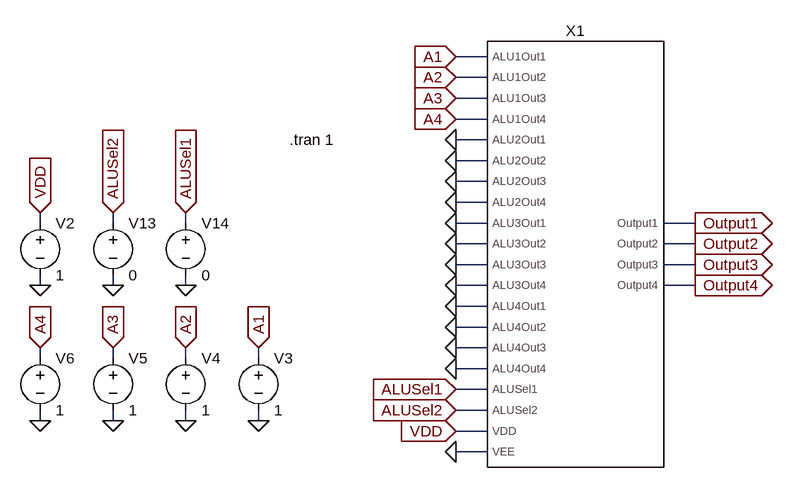
[diagram p0: schematic 16_to_4_Multiplexer_Symbol_Test.asc]
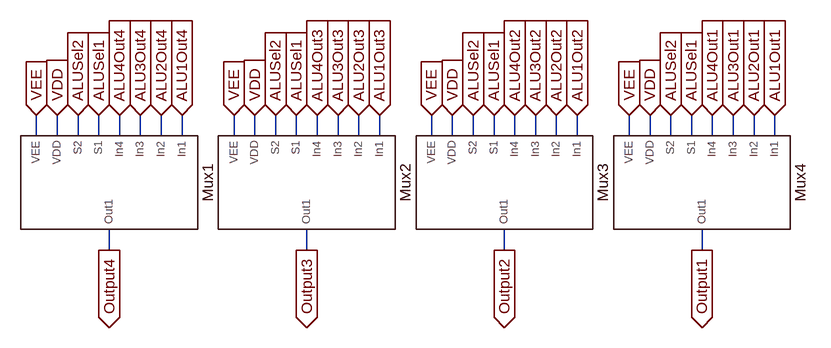
[diagram p1: sub-circuit 16_to_4_multiplexer_symbol.asc]
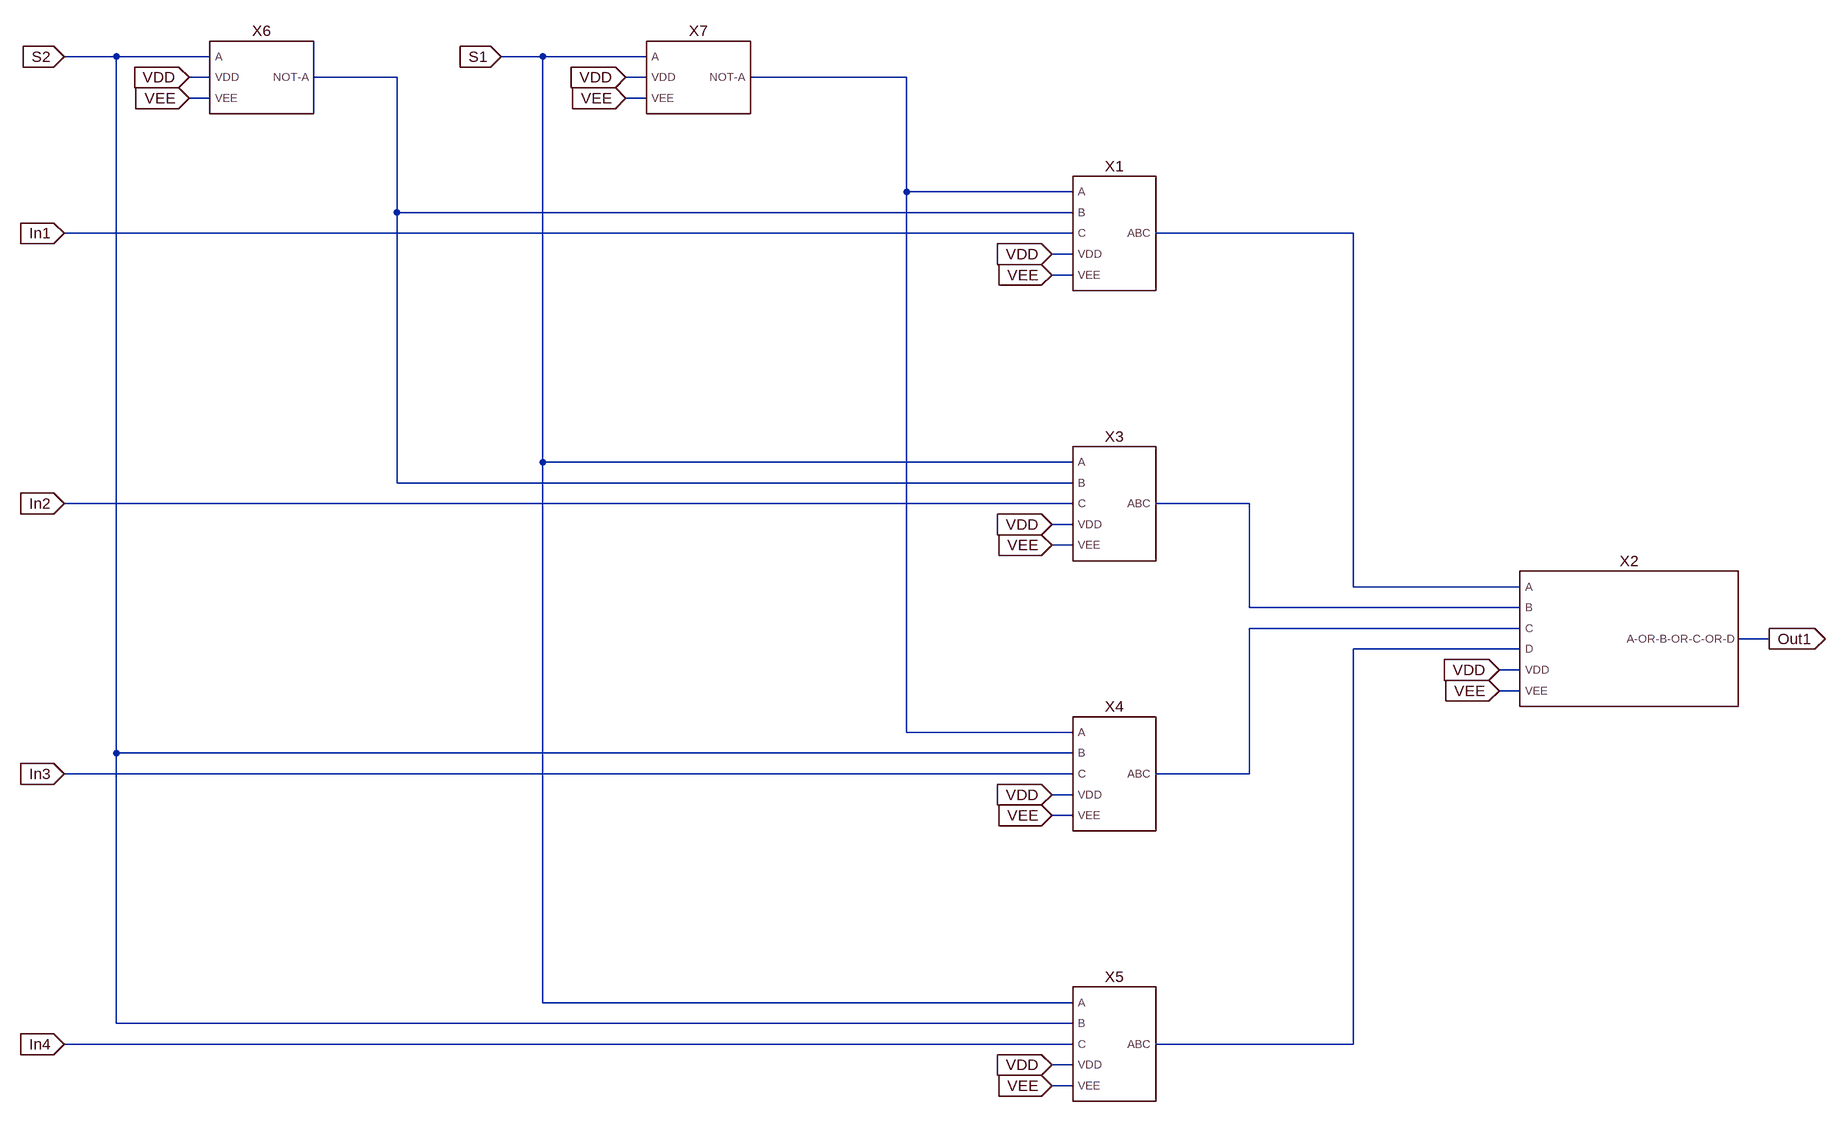
[diagram p2: sub-circuit 4_to_1_multiplexer_symbol.asc]
16_to_4_Multiplexer_Symbol_Test.asc, the LTspice schematic file:
Version 4
SHEET 1 1000 704
WIRE 544 48 496 48
WIRE 544 80 496 80
WIRE 544 112 496 112
WIRE 544 144 496 144
WIRE 544 176 496 176
WIRE 544 208 496 208
WIRE 544 240 496 240
WIRE 544 272 496 272
WIRE -144 304 -144 288
WIRE -32 304 -32 288
WIRE 80 304 80 288
WIRE 544 304 496 304
WIRE 864 304 816 304
WIRE 544 336 496 336
WIRE 864 336 816 336
WIRE 544 368 496 368
WIRE 864 368 816 368
WIRE -144 400 -144 384
WIRE -32 400 -32 384
WIRE 80 400 80 384
WIRE 544 400 496 400
WIRE 864 400 816 400
WIRE 544 432 496 432
WIRE 544 464 496 464
WIRE 544 496 496 496
WIRE -144 512 -144 496
WIRE -32 512 -32 496
WIRE 80 512 80 496
WIRE 192 512 192 496
WIRE 544 528 496 528
WIRE 544 560 496 560
WIRE 544 592 496 592
WIRE -144 608 -144 592
WIRE -32 608 -32 592
WIRE 80 608 80 592
WIRE 192 608 192 592
WIRE 544 624 496 624
WIRE 544 656 496 656
FLAG 80 608 0
FLAG -32 608 0
FLAG -144 608 0
FLAG 192 608 0
FLAG -144 400 0
FLAG -144 288 VDD
IOPIN -144 288 In
FLAG 192 496 A1
IOPIN 192 496 In
FLAG 80 496 A2
IOPIN 80 496 In
FLAG -32 496 A3
IOPIN -32 496 In
FLAG -144 496 A4
IOPIN -144 496 In
FLAG 80 400 0
FLAG -32 400 0
FLAG -32 288 ALUSel2
IOPIN -32 288 In
FLAG 80 288 ALUSel1
IOPIN 80 288 In
FLAG 496 48 A1
IOPIN 496 48 In
FLAG 496 80 A2
IOPIN 496 80 In
FLAG 496 112 A3
IOPIN 496 112 In
FLAG 496 144 A4
IOPIN 496 144 In
FLAG 496 624 VDD
IOPIN 496 624 In
FLAG 496 592 ALUSel2
IOPIN 496 592 In
FLAG 496 560 ALUSel1
IOPIN 496 560 In
FLAG 496 176 0
FLAG 496 208 0
FLAG 496 240 0
FLAG 496 272 0
FLAG 496 304 0
FLAG 496 336 0
FLAG 496 368 0
FLAG 496 400 0
FLAG 496 432 0
FLAG 496 464 0
FLAG 496 496 0
FLAG 496 528 0
FLAG 496 656 0
FLAG 864 304 Output1
IOPIN 864 304 Out
FLAG 864 336 Output2
IOPIN 864 336 Out
FLAG 864 368 Output3
IOPIN 864 368 Out
FLAG 864 400 Output4
IOPIN 864 400 Out
SYMBOL 16_to_4_Multiplexer_Symbol 672 352 R0
SYMATTR InstName X1
SYMBOL Voltage -144 288 R0
SYMATTR InstName V2
SYMATTR Value 1
SYMBOL Voltage 192 496 R0
SYMATTR InstName V3
SYMATTR Value 1
SYMBOL Voltage 80 496 R0
SYMATTR InstName V4
SYMATTR Value 1
SYMBOL Voltage -32 496 R0
SYMATTR InstName V5
SYMATTR Value 1
SYMBOL Voltage -144 496 R0
SYMATTR InstName V6
SYMATTR Value 1
SYMBOL Voltage -32 288 R0
SYMATTR InstName V13
SYMATTR Value 0
SYMBOL Voltage 80 288 R0
SYMATTR InstName V14
SYMATTR Value 0
TEXT 240 176 Left 2 !.tran 1

16_to_4_multiplexer_symbol.asc, the sub-circuit schematic file:
Version 4
SHEET 1 2636 704
WIRE 608 384 608 352
WIRE 640 384 640 352
WIRE 672 384 672 352
WIRE 704 384 704 352
WIRE 736 384 736 352
WIRE 768 384 768 352
WIRE 800 384 800 352
WIRE 832 384 832 352
WIRE 912 384 912 352
WIRE 944 384 944 352
WIRE 976 384 976 352
WIRE 1008 384 1008 352
WIRE 1040 384 1040 352
WIRE 1072 384 1072 352
WIRE 1104 384 1104 352
WIRE 1136 384 1136 352
WIRE 1216 384 1216 352
WIRE 1248 384 1248 352
WIRE 1280 384 1280 352
WIRE 1312 384 1312 352
WIRE 1344 384 1344 352
WIRE 1376 384 1376 352
WIRE 1408 384 1408 352
WIRE 1440 384 1440 352
WIRE 1520 384 1520 352
WIRE 1552 384 1552 352
WIRE 1584 384 1584 352
WIRE 1616 384 1616 352
WIRE 1648 384 1648 352
WIRE 1680 384 1680 352
WIRE 1712 384 1712 352
WIRE 1744 384 1744 352
WIRE 720 560 720 528
WIRE 1024 560 1024 528
WIRE 1328 560 1328 528
WIRE 1632 560 1632 528
FLAG 704 352 ALUSel1
IOPIN 704 352 In
FLAG 672 352 ALUSel2
IOPIN 672 352 In
FLAG 640 352 VDD
IOPIN 640 352 In
FLAG 608 352 VEE
IOPIN 608 352 In
FLAG 720 560 Output4
IOPIN 720 560 Out
FLAG 1008 352 ALUSel1
IOPIN 1008 352 In
FLAG 976 352 ALUSel2
IOPIN 976 352 In
FLAG 944 352 VDD
IOPIN 944 352 In
FLAG 912 352 VEE
IOPIN 912 352 In
FLAG 1024 560 Output3
IOPIN 1024 560 Out
FLAG 1312 352 ALUSel1
IOPIN 1312 352 In
FLAG 1280 352 ALUSel2
IOPIN 1280 352 In
FLAG 1248 352 VDD
IOPIN 1248 352 In
FLAG 1216 352 VEE
IOPIN 1216 352 In
FLAG 1328 560 Output2
IOPIN 1328 560 Out
FLAG 1616 352 ALUSel1
IOPIN 1616 352 In
FLAG 1584 352 ALUSel2
IOPIN 1584 352 In
FLAG 1552 352 VDD
IOPIN 1552 352 In
FLAG 1520 352 VEE
IOPIN 1520 352 In
FLAG 1632 560 Output1
IOPIN 1632 560 Out
FLAG 736 352 ALU4Out4
IOPIN 736 352 In
FLAG 768 352 ALU3Out4
IOPIN 768 352 In
FLAG 800 352 ALU2Out4
IOPIN 800 352 In
FLAG 832 352 ALU1Out4
IOPIN 832 352 In
FLAG 1040 352 ALU4Out3
IOPIN 1040 352 In
FLAG 1072 352 ALU3Out3
IOPIN 1072 352 In
FLAG 1104 352 ALU2Out3
IOPIN 1104 352 In
FLAG 1136 352 ALU1Out3
IOPIN 1136 352 In
FLAG 1344 352 ALU4Out2
IOPIN 1344 352 In
FLAG 1376 352 ALU3Out2
IOPIN 1376 352 In
FLAG 1408 352 ALU2Out2
IOPIN 1408 352 In
FLAG 1440 352 ALU1Out2
IOPIN 1440 352 In
FLAG 1648 352 ALU4Out1
IOPIN 1648 352 In
FLAG 1680 352 ALU3Out1
IOPIN 1680 352 In
FLAG 1712 352 ALU2Out1
IOPIN 1712 352 In
FLAG 1744 352 ALU1Out1
IOPIN 1744 352 In
SYMBOL 4_to_1_Multiplexer_Symbol 720 448 R90
SYMATTR InstName Mux1
SYMBOL 4_to_1_Multiplexer_Symbol 1024 448 R90
SYMATTR InstName Mux2
SYMBOL 4_to_1_Multiplexer_Symbol 1328 448 R90
SYMATTR InstName Mux3
SYMBOL 4_to_1_Multiplexer_Symbol 1632 448 R90
SYMATTR InstName Mux4

4_to_1_multiplexer_symbol.asc, the sub-circuit schematic file:
Version 4
SHEET 1 1332 1692
WIRE -1312 48 -1392 48
WIRE -1168 48 -1312 48
WIRE -656 48 -720 48
WIRE -496 48 -656 48
WIRE -1168 80 -1200 80
WIRE -880 80 -1008 80
WIRE -496 80 -528 80
WIRE -96 80 -336 80
WIRE -1168 112 -1200 112
WIRE -496 112 -528 112
WIRE -96 256 -96 80
WIRE 160 256 -96 256
WIRE -880 288 -880 80
WIRE 160 288 -880 288
WIRE 160 320 -1392 320
WIRE 592 320 288 320
WIRE 160 352 128 352
WIRE 160 384 128 384
WIRE -656 672 -656 48
WIRE 160 672 -656 672
WIRE -880 704 -880 288
WIRE 160 704 -880 704
WIRE 160 736 -1392 736
WIRE 432 736 288 736
WIRE 160 768 128 768
WIRE 160 800 128 800
WIRE 592 864 592 320
WIRE 848 864 592 864
WIRE 432 896 432 736
WIRE 848 896 432 896
WIRE 848 928 432 928
WIRE 1232 944 1184 944
WIRE 848 960 592 960
WIRE 848 992 816 992
WIRE 848 1024 816 1024
WIRE -96 1088 -96 256
WIRE 160 1088 -96 1088
WIRE -1312 1120 -1312 48
WIRE 160 1120 -1312 1120
WIRE 160 1152 -1392 1152
WIRE 432 1152 432 928
WIRE 432 1152 288 1152
WIRE 160 1184 128 1184
WIRE 160 1216 128 1216
WIRE -656 1504 -656 672
WIRE 160 1504 -656 1504
WIRE -1312 1536 -1312 1120
WIRE 160 1536 -1312 1536
WIRE 160 1568 -1392 1568
WIRE 592 1568 592 960
WIRE 592 1568 288 1568
WIRE 160 1600 128 1600
WIRE 160 1632 128 1632
FLAG -1200 80 VDD
IOPIN -1200 80 In
FLAG -528 80 VDD
IOPIN -528 80 In
FLAG 128 352 VDD
IOPIN 128 352 In
FLAG 128 768 VDD
IOPIN 128 768 In
FLAG 128 1184 VDD
IOPIN 128 1184 In
FLAG 128 1600 VDD
IOPIN 128 1600 In
FLAG 816 992 VDD
IOPIN 816 992 In
FLAG -720 48 S1
IOPIN -720 48 In
FLAG -1392 48 S2
IOPIN -1392 48 In
FLAG -1392 320 In1
IOPIN -1392 320 In
FLAG -1392 736 In2
IOPIN -1392 736 In
FLAG -1392 1152 In3
IOPIN -1392 1152 In
FLAG -1392 1568 In4
IOPIN -1392 1568 In
FLAG 1232 944 Out1
IOPIN 1232 944 Out
FLAG -1200 112 VEE
IOPIN -1200 112 In
FLAG -528 112 VEE
IOPIN -528 112 In
FLAG 128 384 VEE
IOPIN 128 384 In
FLAG 128 800 VEE
IOPIN 128 800 In
FLAG 128 1216 VEE
IOPIN 128 1216 In
FLAG 128 1632 VEE
IOPIN 128 1632 In
FLAG 816 1024 VEE
IOPIN 816 1024 In
SYMBOL 3_Input_AND_Gate_Symbol 224 320 R0
SYMATTR InstName X1
SYMBOL 4_Input_OR_Gate_Symbol 1008 944 R0
SYMATTR InstName X2
SYMBOL 3_Input_AND_Gate_Symbol 224 736 R0
SYMATTR InstName X3
SYMBOL 3_Input_AND_Gate_Symbol 224 1152 R0
SYMATTR InstName X4
SYMBOL 3_Input_AND_Gate_Symbol 224 1568 R0
SYMATTR InstName X5
SYMBOL Inverter_Gate_Symbol -1088 80 R0
SYMATTR InstName X6
SYMBOL Inverter_Gate_Symbol -416 80 R0
SYMATTR InstName X7

The netlist it stands for:
* 16_to_4_Multiplexer_Symbol_Test.asc
XX1 A1 A2 A3 A4 0 0 0 0 0 0 0 0 0 0 0 0 ALUSel1 ALUSel2 VDD 0 Output1 Output2 Output3 Output4 16_to_4_multiplexer_symbol
V2 VDD 0 1
V3 A1 0 1
V4 A2 0 1
V5 A3 0 1
V6 A4 0 1
V13 ALUSel2 0 0
V14 ALUSel1 0 0

* block symbol definitions
.subckt 16_to_4_multiplexer_symbol ALU1Out1 ALU1Out2 ALU1Out3 ALU1Out4 ALU2Out1 ALU2Out2 ALU2Out3 ALU2Out4 ALU3Out1 ALU3Out2 ALU3Out3 ALU3Out4 ALU4Out1 ALU4Out2 ALU4Out3 ALU4Out4 ALUSel1 ALUSel2 VDD VEE Output1 Output2 Output3 Output4
XMux1 ALU1Out4 ALU2Out4 ALU3Out4 ALU4Out4 ALUSel1 ALUSel2 VDD VEE Output4 4_to_1_multiplexer_symbol
XMux2 ALU1Out3 ALU2Out3 ALU3Out3 ALU4Out3 ALUSel1 ALUSel2 VDD VEE Output3 4_to_1_multiplexer_symbol
XMux3 ALU1Out2 ALU2Out2 ALU3Out2 ALU4Out2 ALUSel1 ALUSel2 VDD VEE Output2 4_to_1_multiplexer_symbol
XMux4 ALU1Out1 ALU2Out1 ALU3Out1 ALU4Out1 ALUSel1 ALUSel2 VDD VEE Output1 4_to_1_multiplexer_symbol
.ends 16_to_4_multiplexer_symbol

.subckt 4_to_1_multiplexer_symbol In1 In2 In3 In4 S1 S2 VDD VEE Out1
XX1 N002 N001 In1 VDD VEE N003 3_Input_AND_Gate_Symbol  ; pins A B C VDD VEE ABC
XX2 N003 N004 N005 N006 VDD VEE Out1 4_Input_OR_Gate_Symbol  ; pins A B C D VDD VEE A-OR-B-OR-C-OR-D
XX3 S1 N001 In2 VDD VEE N004 3_Input_AND_Gate_Symbol  ; pins A B C VDD VEE ABC
XX4 N002 S2 In3 VDD VEE N005 3_Input_AND_Gate_Symbol  ; pins A B C VDD VEE ABC
XX5 S1 S2 In4 VDD VEE N006 3_Input_AND_Gate_Symbol  ; pins A B C VDD VEE ABC
XX6 S2 VDD VEE N001 Inverter_Gate_Symbol  ; pins A VDD VEE NOT-A
XX7 S1 VDD VEE N002 Inverter_Gate_Symbol  ; pins A VDD VEE NOT-A
.ends 4_to_1_multiplexer_symbol

.tran 1
.backanno
.end